# EAGLE design A502X (EAGLE 6.6.0)
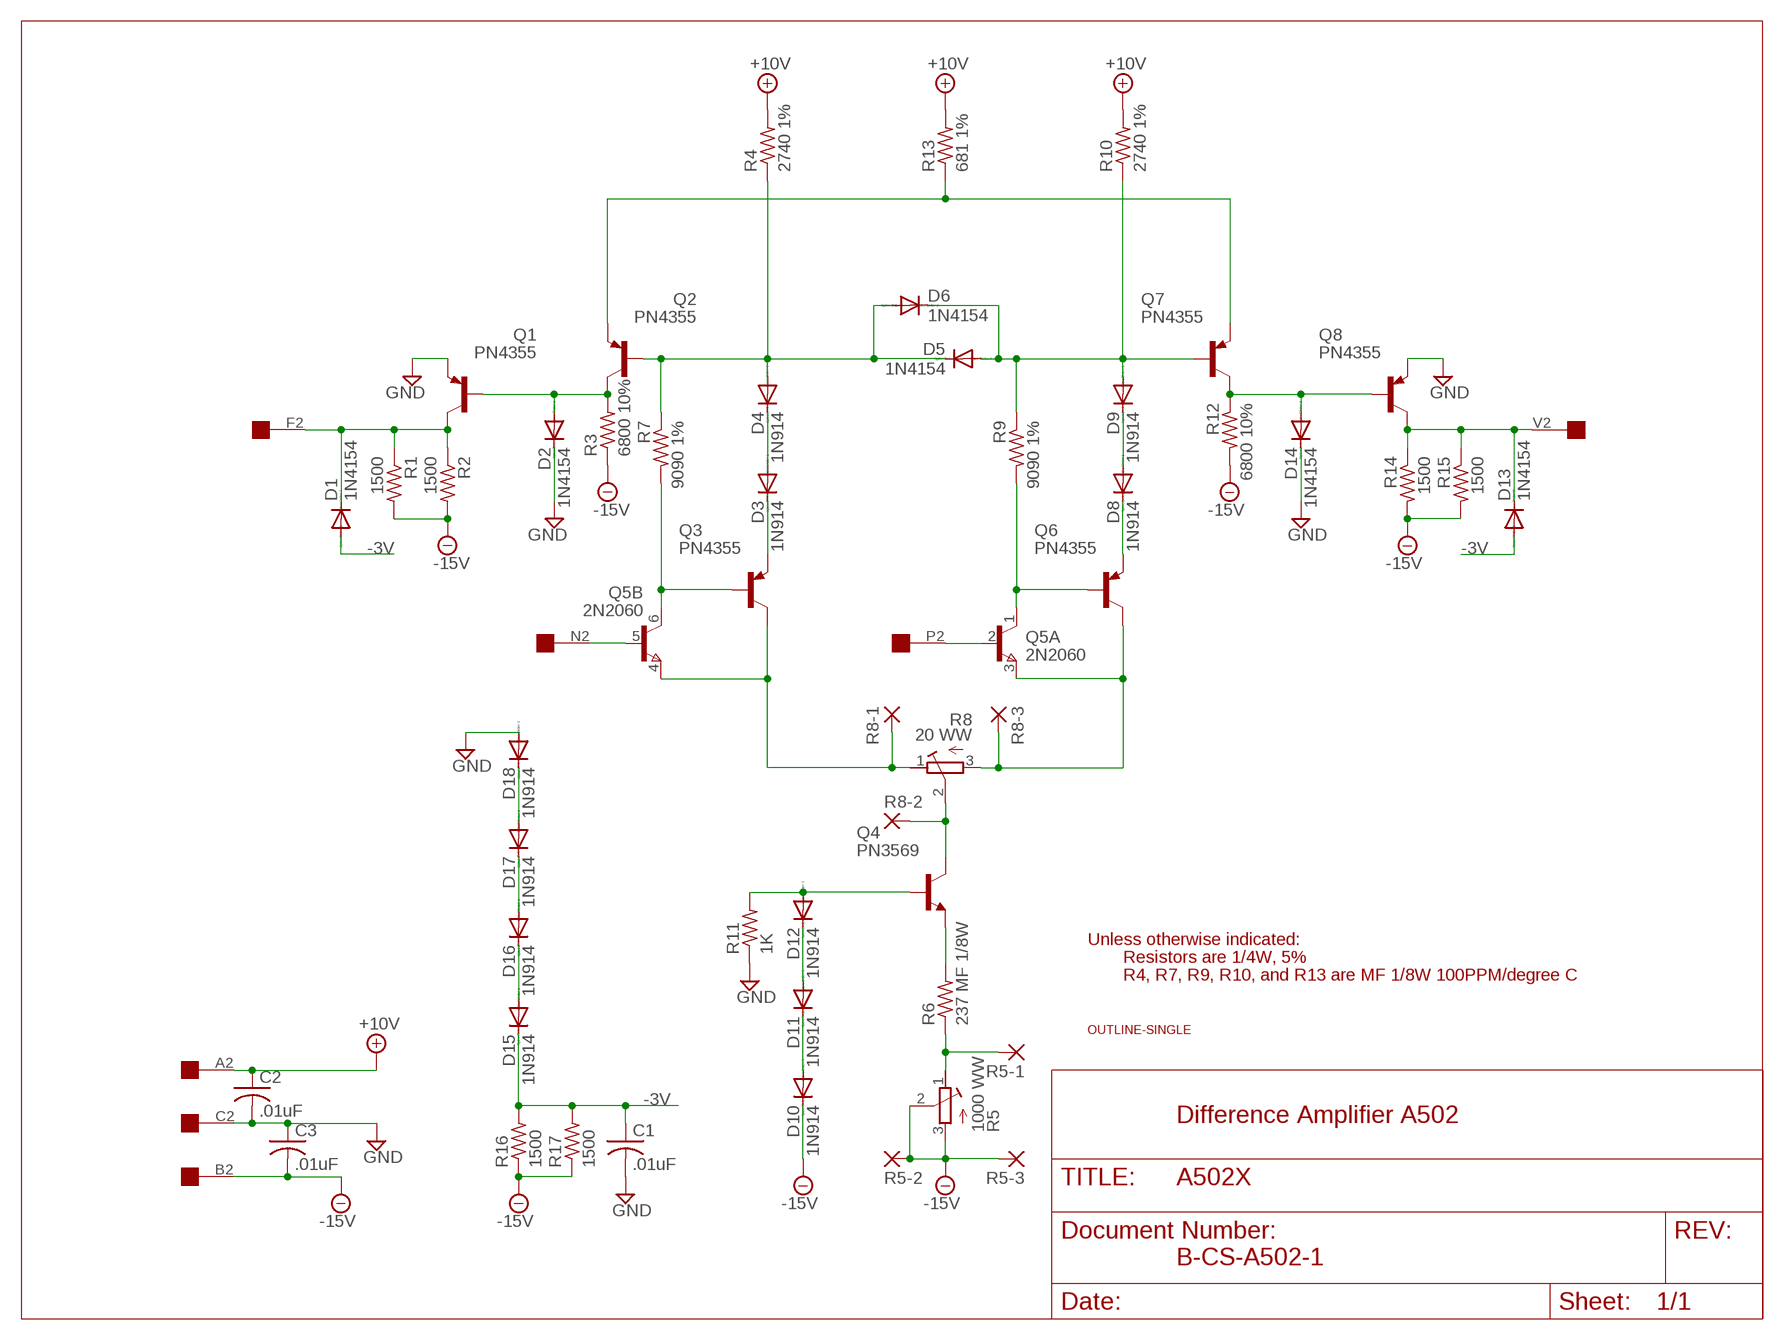
[diagram p0: schematic, sheet 1]

## Parts
C1  .01uF  C-US050-025X075  [C050-025X075]
C2  .01uF  C-US050-025X075  [C050-025X075]
C3  .01uF  C-US050-025X075  [C050-025X075]
D1  1N4154  1N4148DO35-10  [DO35-10]
D2  1N4154  1N4148DO35-10  [DO35-10]
D3  1N914  1N4148DO35-10  [DO35-10]
D4  1N914  1N4148DO35-10  [DO35-10]
D5  1N4154  1N4148DO35-10  [DO35-10]
D6  1N4154  1N4148DO35-10  [DO35-10]
D8  1N914  1N4148DO35-10  [DO35-10]
D9  1N914  1N4148DO35-10  [DO35-10]
D10  1N914  1N4148DO35-10  [DO35-10]
D11  1N914  1N4148DO35-10  [DO35-10]
D12  1N914  1N4148DO35-10  [DO35-10]
D13  1N4154  1N4148DO35-10  [DO35-10]
D14  1N4154  1N4148DO35-10  [DO35-10]
D15  1N914  1N4148DO35-10  [DO35-10]
D16  1N914  1N4148DO35-10  [DO35-10]
D17  1N914  1N4148DO35-10  [DO35-10]
D18  1N914  1N4148DO35-10  [DO35-10]
Q1  PN4355  2N2904A  [TO39]
Q2  PN4355  2N2904A  [TO39]
Q3  PN4355  2N2904A  [TO39]
Q4  PN3569  2N2219  [TO5]
Q5  2N2060  MAT-02H  [TO78]
Q6  PN4355  2N2904A  [TO39]
Q7  PN4355  2N2904A  [TO39]
Q8  PN4355  2N2904A  [TO39]
R1  1500  R-US_0207/10  [0207/10]
R2  1500  R-US_0207/10  [0207/10]
R3  6800 10%  R-US_0207/10  [0207/10]
R4  2740 1%  R-US_0207/15  [0207/15]
R5  1000 WW  275P  [3006Y]
R5-1  2,54/0,8  [2,54/0,8]
R5-2  2,54/0,8  [2,54/0,8]
R5-3  2,54/0,8  [2,54/0,8]
R6  237 MF 1/8W  R-US_0207/15  [0207/15]
R7  9090 1%  R-US_0207/15  [0207/15]
R8  20 WW  275P  [3006Y]
R8-1  2,54/0,8  [2,54/0,8]
R8-2  2,54/0,8  [2,54/0,8]
R8-3  2,54/0,8  [2,54/0,8]
R9  9090 1%  R-US_0207/15  [0207/15]
R10  2740 1%  R-US_0207/15  [0207/15]
R11  1K  R-US_0207/10  [0207/10]
R12  6800 10%  R-US_0207/10  [0207/10]
R13  681 1%  R-US_0207/15  [0207/15]
R14  1500  R-US_0207/10  [0207/10]
R15  1500  R-US_0207/10  [0207/10]
R16  1500  R-US_0207/10  [0207/10]
R17  1500  R-US_0207/10  [0207/10]
U$2  OUTLINE-SINGLE  [SINGLE]
U$3  EDGE-1  [EDGE-CON1]

## Nets
+10V: C2.1 R4.2 R10.2 R13.2 U$3.A2
-3V: C1.1 D1.A D13.A D15.C R16.2 R17.2
-15V [supply]: C3.2 D10.C R1.2 R2.2 R3.1 R5-2.1(P) R5-3.1(P) R5.2(S) R5.3(E) R12.2 R14.2 R15.2 R16.1 R17.1 U$3.B2
GND [supply]: C1.2 C2.2 C3.1 D2.C D14.C D18.A Q1.1(E) Q8.1(E) R11.1 U$3.C2
N$1: Q5.2(A:B) U$3.P2
N$2: Q5.5(B:B) U$3.N2
N$3: Q5.3(A:E) Q6.3(C) R8-3.1(P) R8.3(E)
N$4: Q5.1(A:C) Q6.2(B) R9.2
N$5: Q3.3(C) Q5.4(B:E) R8-1.1(P) R8.1(A)
N$6: Q3.2(B) Q5.6(B:C) R7.2
N$7: D12.A Q4.2(B) R11.2
N$8: D17.A D18.C
N$9: Q4.3(C) R8-2.1(P) R8.2(S)
N$10: R5-1.1(P) R5.1(A) R6.1
N$11: D16.A D17.C
N$12: D15.A D16.C
N$13: D1.C Q1.3(C) R1.1 R2.1 U$3.F2
N$14: D10.A D11.C
N$15: D2.A Q1.2(B) Q2.3(C) R3.2
N$16: D5.A D6.C D9.A Q7.2(B) R9.1 R10.1
N$17: D11.A D12.C
N$18: D14.A Q7.3(C) Q8.2(B) R12.1
N$19: D13.C Q8.3(C) R14.1 R15.1 U$3.V2
N$20: D4.A D5.C D6.A Q2.2(B) R4.1 R7.1
N$21: Q2.1(E) Q7.1(E) R13.1
N$22: D3.A D4.C
N$23: Q4.1(E) R6.2
N$24: D8.A D9.C
N$25: D3.C Q3.1(E)
N$26: D8.C Q6.1(E)
Unconnected: U$3.D2 U$3.E2 U$3.H2 U$3.J2 U$3.K2 U$3.L2 U$3.M2 U$3.R2 U$3.S2 U$3.T2 U$3.U2

## Notes on the sheet
- Unless otherwise indicated:
- Resistors are 1/4W, 5%
- R4, R7, R9, R10, and R13 are MF 1/8W 100PPM/degree C
- Difference Amplifier A502
- B-CS-A502-1

## Library data of the parts
C1-C3 = rcl:C-US: CAPACITOR, American symbol
D1-D6 D8-D18 = diode:1N4148: DIODE high speed (Philips)
Q1-Q3 Q6-Q8 = transistor-pnp:2N2904*: PNP Transistror
Q4 = transistor:2N2219: NPN TRANSISTOR
Q5 = linear:MAT-02H: Dual TRANSISTOR
R1-R4 R6 R7 R9-R17 = rcl:R-US_: RESISTOR, American symbol
R5 R8 = dec-con:275P: Trimpot with 275P (3006Y) footprint.
R5-1-R5-3 R8-1-R8-3 = wirepad:2,54/0,8: THROUGH-HOLE PAD
U$2 = dec-con:OUTLINE-*: Board outlines for DEC boards.
U$3 = dec-con:EDGE-1: Single-Sided DEC Edge Connector -- (side 2)

## Board
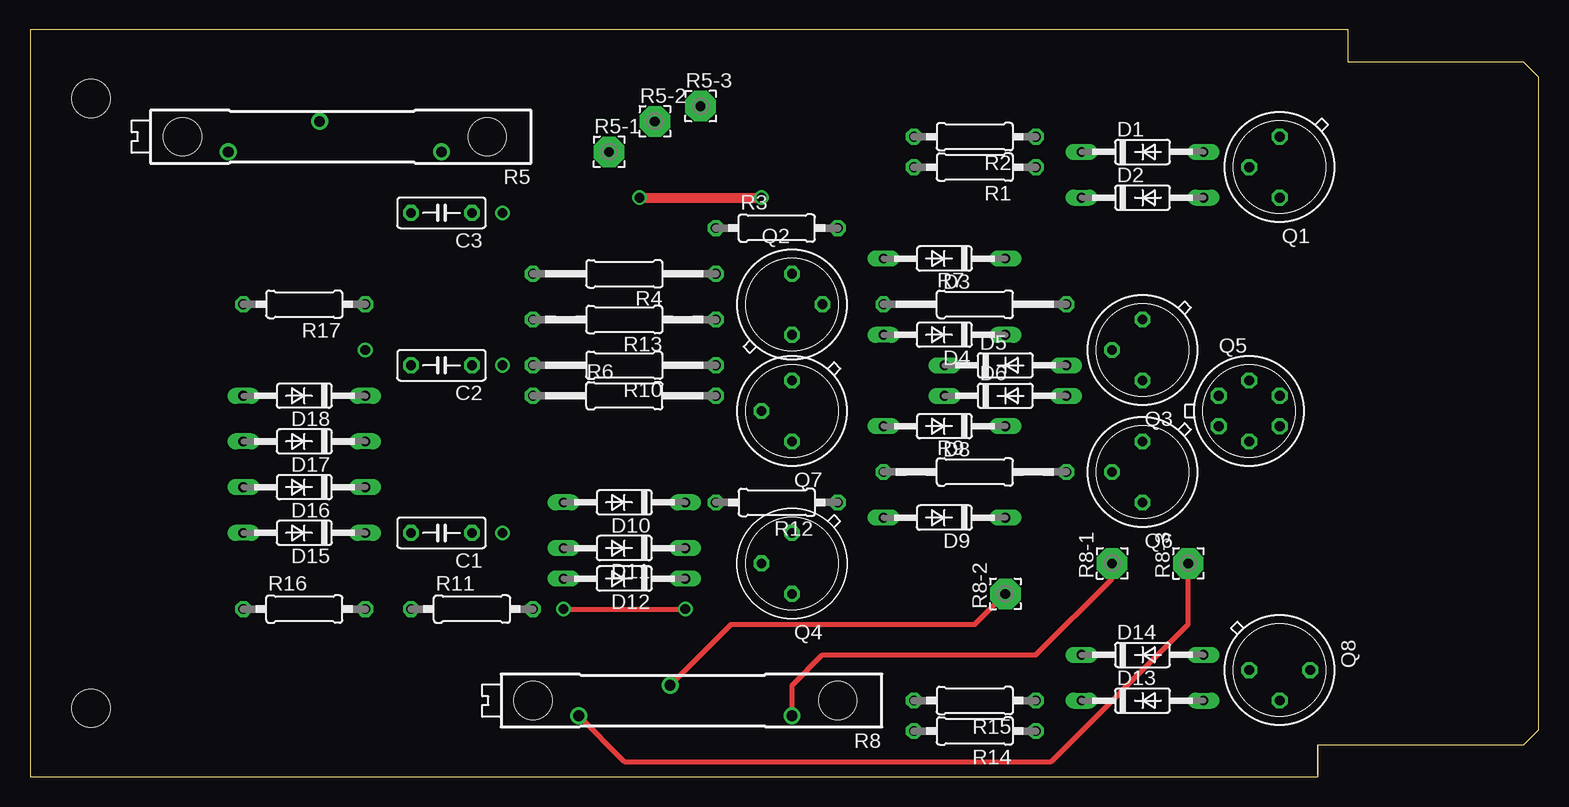
[diagram p1: board, top side]
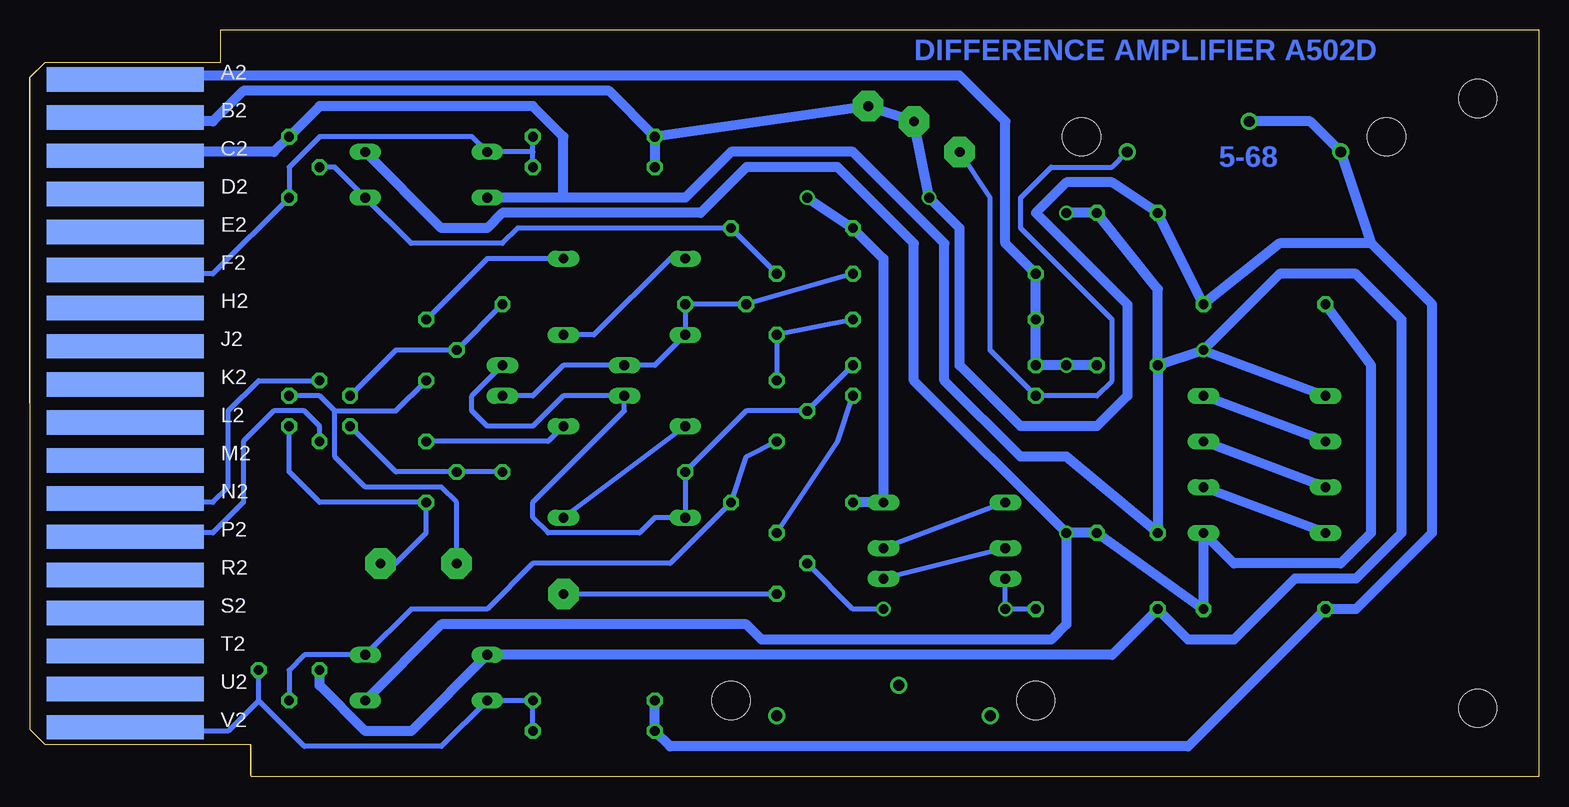
[diagram p2: board, bottom side, seen from below]

Size 125.73 x 62.23 mm. Coordinates in mm from the lower left corner, seen from the top.
Copper layers (1+16): Top 0.035mm / dielectric 1.5mm / Bottom 0.035mm
Design rules "16mils": minimum track width 16mil, minimum drill 32mil, track to track 15mil, track to pad 10mil, pad to pad 10mil, via to via 10mil, smd to smd 10mil, copper to edge 13mil, drill to drill 10mil, minimum pad ring 10mil, minimum via ring 8mil, stop-mask expansion 0mil, vias tented up to drill 0mil, thermal gap 10mil
Holes 3.17 mm at 41.91,6.35 67.31,6.35 12.7,53.34 38.1,53.34

### Footprints (pad centres in the part's own frame; a part is rotated, then mirrored left to right if it is on the bottom)
C050-025X075 = drill 0.813 octagon: 1 -2.54,0; 2 2.54,0
DO35-10 = drill 0.813 long: A 5.08,0; C -5.08,0
TO39 = drill 0.813 octagon: 1 0,-2.54; 2 2.54,0; 3 0,2.54
TO5 = drill 0.813 octagon: 1 0,-2.54; 2 2.54,0; 3 0,2.54
TO78 = drill 0.813 octagon: 1 -2.54,-1.27; 2 0,-2.54; 3 2.54,-1.27; 4 2.54,1.27; 5 0,2.54; 6 -2.54,1.27
0207/10 = drill 0.813 octagon: 1 -5.08,0; 2 5.08,0
0207/15 = drill 0.813 octagon: 1 -7.62,0; 2 7.62,0
3006Y = drill 0.9: 1 -8.89,1.27; 2 1.27,-1.27; 3 8.89,1.27
2,54/0,8 = drill 0.813 pad 2.54 octagon: 1 0,0
SINGLE = hole 3.175: 120.65,56.515; 120.65,5.715
EDGE-CON1 = smd 13.106 x 2.032 bottom: A2 7.938,4.128; B2 7.938,7.303; C2 7.938,10.477; D2 7.938,13.652; E2 7.938,16.828; F2 7.938,20.003; H2 7.938,23.177; J2 7.938,26.352; K2 7.938,29.527; L2 7.938,32.703; M2 7.938,35.877; N2 7.938,39.053; P2 7.938,42.227; R2 7.938,45.403; S2 7.938,48.578; T2 7.938,51.752; U2 7.938,54.928; V2 7.938,58.102

### Placement (x,y rotation side)
C1  34.29,20.32 180 top
C2  34.29,34.29 180 top
C3  34.29,46.99 180 top
D1  92.71,52.07 0 top
D2  92.71,48.26 0 top
D3  76.2,43.18 180 top
D4  76.2,36.83 180 top
D5  81.28,34.29 0 top
D6  81.28,31.75 0 top
D8  76.2,29.21 180 top
D9  76.2,21.59 180 top
D10  49.53,22.86 180 top
D11  49.53,19.05 180 top
D12  49.53,16.51 180 top
D13  92.71,6.35 0 top
D14  92.71,10.16 0 top
D15  22.86,20.32 180 top
D16  22.86,24.13 180 top
D17  22.86,27.94 180 top
D18  22.86,31.75 180 top
Q1  104.14,50.8 180 top
Q2  63.5,39.37 0 top
Q3  92.71,35.56 180 top
Q4  63.5,17.78 180 top
Q5  101.6,30.48 0 top
Q6  92.71,25.4 180 top
Q7  63.5,30.48 180 top
Q8  104.14,8.89 270 top
R1  78.74,50.8 180 top
R2  78.74,53.34 180 top
R3  62.23,45.72 0 top
R4  49.53,41.91 180 top
R5  25.4,53.34 180 top
R5-1  48.26,52.07 0 top
R5-2  52.07,54.61 0 top
R5-3  55.88,55.88 0 top
R6  49.53,31.75 0 top
R7  78.74,39.37 0 top
R8  54.61,6.35 180 top
R8-1  90.17,17.78 90 top
R8-2  81.28,15.24 90 top
R8-3  96.52,17.78 90 top
R9  78.74,25.4 0 top
R10  49.53,34.29 180 top
R11  36.83,13.97 0 top
R12  62.23,22.86 180 top
R13  49.53,38.1 180 top
R14  78.74,3.81 180 top
R15  78.74,6.35 180 top
R16  22.86,13.97 0 top
R17  22.86,39.37 180 top
U$2  125.73,62.23 180 top
U$3  125.73,62.23 180 top

### Tracks (layer width: path | path; a pad name or v marks a point on that pad's centre or on a via)
+10V  (via drill 0.81)
  Bottom 0.813: U$3.A2 117.22,58.04 116.84,58.42 48.26,58.42 44.45,54.61 44.45,44.45 R4.2 R13.2 R10.2 v39.37,34.29 C2.1
-3V  (via drill 0.81)
  Bottom 0.813: R17.2 13.97,34.29 13.97,20.32 16.51,17.78 25.4,17.78 D15.C R16.2 C1.1 v39.37,20.32 | D1.A 91.44,45.72 87.63,45.72 86.36,46.99 69.85,46.99 66.04,50.8 58.42,50.8 52.07,44.45 52.07,33.02 v39.37,20.32 | D13.A 91.44,12.7 66.04,12.7 64.77,11.43 40.64,11.43 39.37,12.7 v39.37,20.32
-15V  (via drill 0.81)
  Top 0.813: v50.8,48.26 v60.96,48.26
  Bottom 0.813: U$3.B2 117.13,54.9 116.84,54.61 110.49,54.61 107.95,57.15 77.47,57.15 R2.2 | R2.2 R1.2 | R2.2 R5-3.1 R5-2.1 v50.8,48.26 48.26,45.72 48.26,34.29 43.18,29.21 36.83,29.21 34.29,31.75 34.29,39.37 41.91,46.99 39.37,49.53 35.56,49.53 C3.2 R17.1 21.59,44.45 13.97,44.45 | v60.96,48.26 R3.1 54.61,43.18 D10.C R12.2 | 13.97,44.45 8.89,39.37 8.89,20.32 15.24,13.97 R16.1 29.21,2.54 72.39,2.54 R14.2 R15.2 | R5.2 19.05,54.61 R5.3 13.97,44.45
GND  (via drill 0.81)
  Bottom 0.813: U$3.C2 117.17,51.74 116.84,52.07 105.41,52.07 Q1.1 101.6,55.88 83.82,55.88 81.28,53.34 81.28,48.26 | 81.28,48.26 71.12,48.26 67.31,52.07 57.15,52.07 49.53,44.45 49.53,33.02 43.18,26.67 39.37,26.67 C1.2 C2.2 | C2.2 31.75,40.64 C3.1 v39.37,46.99 | v27.94,35.56 C2.2 | v27.94,35.56 D18.A | v27.94,35.56 21.59,41.91 15.24,41.91 11.43,38.1 11.43,20.32 15.24,16.51 20.32,16.51 25.4,11.43 29.21,11.43 R11.1 35.56,10.16 D14.C 93.98,3.81 97.79,3.81 101.6,7.62 Q8.1 | 81.28,48.26 D2.C
N$1
  Bottom 0.406: Q5.2 101.6,29.21 102.87,30.48 105.41,30.48 107.95,27.94 107.95,22.86 110.49,20.32 116.84,20.32 117.17,19.99 U$3.P2
N$2
  Bottom 0.406: U$3.N2 117.17,23.19 116.84,22.86 110.49,22.86 109.22,24.13 109.22,30.48 106.68,33.02 Q5.5
N$3
  Top 0.406: R8.3 49.53,1.27 85.09,1.27 96.52,12.7 R8-3.1
  Bottom 0.406: Q5.3 104.14,25.4 101.6,22.86 Q6.3 92.71,20.32 95.25,17.78 R8-3.1
N$4
  Bottom 0.406: Q5.1 95.25,25.4 Q6.2 R9.2
N$5
  Top 0.406: R8.1 63.5,7.62 66.04,10.16 83.82,10.16 90.17,16.51 R8-1.1
  Bottom 0.406: Q5.4 101.6,31.75 100.33,30.48 | 100.33,30.48 95.25,30.48 Q3.3 | 100.33,30.48 100.33,26.67 97.79,24.13 91.44,24.13 90.17,22.86 R8-1.1
N$6
  Bottom 0.406: Q5.6 95.25,35.56 Q3.2 R7.2
N$7  (via drill 0.81)
  Top 0.406: v44.45,13.97 v54.61,13.97
  Bottom 0.406: Q4.2 57.15,13.97 v54.61,13.97 | D12.A v44.45,13.97 R11.2
N$8
  Bottom 0.813: D17.A D18.C
N$9
  Top 0.406: R8.2 58.42,12.7 78.74,12.7 R8-2.1
  Bottom 0.406: R8-2.1 Q4.3
N$10
  Bottom 0.406: R5.1 35.56,50.8 40.64,50.8 43.18,48.26 43.18,45.72 35.56,38.1 35.56,33.02 36.83,31.75 R6.1 45.72,35.56 45.72,48.26 R5-1.1
N$11
  Bottom 0.813: D16.A D17.C
N$12
  Bottom 0.813: D15.A D16.C
N$13
  Bottom 0.406: U$3.F2 117.12,42.19 116.84,41.91 110.49,41.91 Q1.3 104.14,50.8 101.6,53.34 88.9,53.34 D1.C 83.82,52.07 R1.1 | R1.1 R2.1 R1.1
N$14
  Bottom 0.406: D10.A D11.C
N$15
  Bottom 0.406: Q1.2 100.33,50.8 D2.A 93.98,44.45 86.36,44.45 85.09,45.72 R3.2 Q2.3
N$16
  Bottom 0.406: R10.1 Q7.2 66.04,30.48 R9.1 D9.A 73.66,21.59 74.93,20.32 82.55,20.32 83.82,21.59 83.82,22.86 76.2,30.48 D6.C 81.28,31.75 83.82,29.21 87.63,29.21 88.9,30.48 88.9,31.75 D5.A
N$17
  Bottom 0.406: D11.A D12.C
N$18
  Bottom 0.406: Q7.3 66.04,26.67 R12.1 72.39,17.78 83.82,17.78 87.63,13.97 93.98,13.97 D14.A 102.87,10.16 104.14,8.89 Q8.2
N$19
  Bottom 0.406: U$3.V2 117.16,4.13 116.84,3.81 109.22,3.81 106.68,6.35 | 106.68,6.35 Q8.3 | R14.1 R15.1 D13.C 91.44,2.54 102.87,2.54 106.68,6.35
N$20
  Bottom 0.406: R4.1 Q2.2 R7.1 D4.A 73.66,34.29 D5.C 81.28,34.29 83.82,31.75 D6.A
N$21
  Bottom 0.406: R13.1 Q2.1 Q7.1
N$22
  Bottom 0.406: D4.C 78.74,36.83 72.39,43.18 D3.A
N$23
  Bottom 0.406: R6.2 58.42,27.94 Q4.1
N$24
  Bottom 0.406: D8.A D9.C
N$25
  Bottom 0.406: D3.C 87.63,43.18 Q3.1
N$26
  Bottom 0.406: Q6.1 82.55,27.94 D8.C

### Text on the board
Bottom: DIFFERENCE AMPLIFIER A502D | 5-68